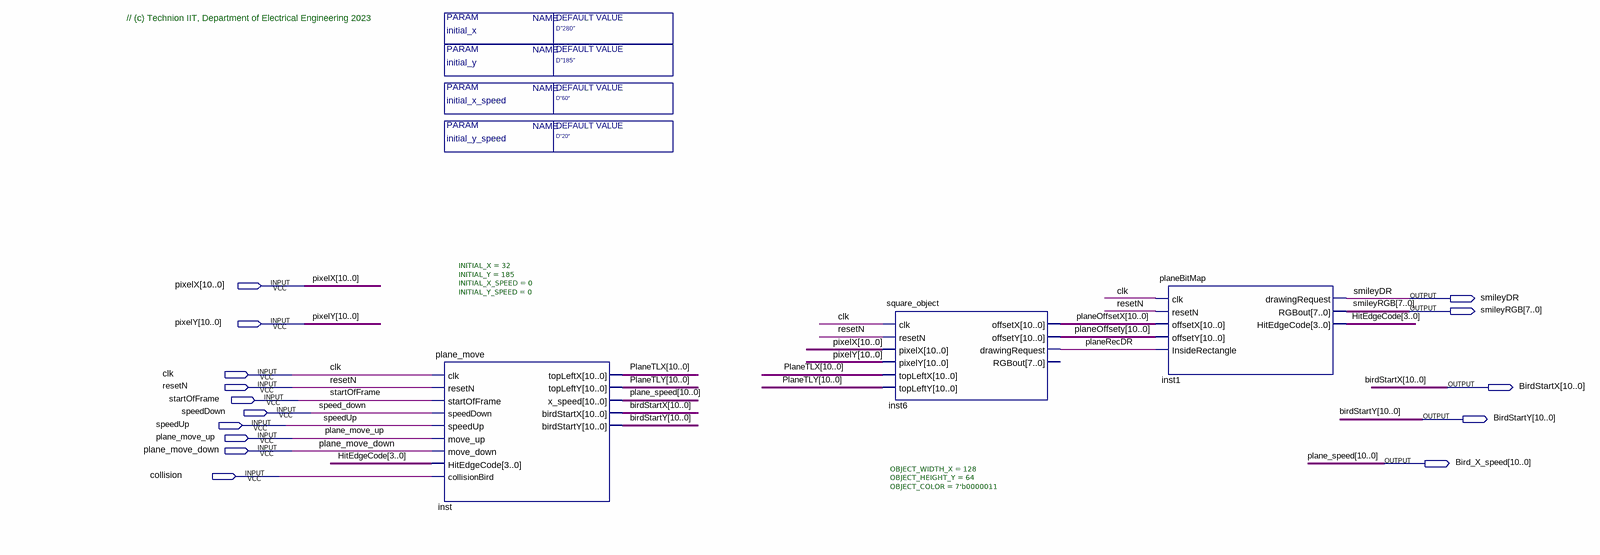
[diagram p0: schematic sheet]
// Quartus schematic Smiley_Block_T.bdf as structural Verilog: 3 symbols, 15 pins
module Smiley_Block_T #(parameter initial_x = "D\"280\"", parameter initial_y = "D\"185\"", parameter initial_x_speed = "D\"60\"", parameter initial_y_speed = "D\"20\"") (
  input  [10:0] pixelX,
  input  [10:0] pixelY,
  input  clk,
  input  resetN,
  input  startOfFrame,
  input  speedDown,
  input  speedUp,
  input  plane_move_up,
  input  plane_move_down,
  input  collision,
  output smileyDR,
  output [7:0] smileyRGB,
  output [10:0] BirdStartX,
  output [10:0] BirdStartY,
  output [10:0] Bird_X_speed
);

  wire planeRecDR;
  wire [3:0] HitEdgeCode;
  wire [10:0] planeOffsetX, planeOffsety, PlaneTLX, PlaneTLY;

  plane_move #(.INITIAL_X(32), .INITIAL_Y(185), .INITIAL_X_SPEED(0), .INITIAL_Y_SPEED(0)) inst (
    .clk(clk), .resetN(resetN), .startOfFrame(startOfFrame), .speedDown(speedDown), .speedUp(speedUp),
    .move_up(plane_move_up), .move_down(plane_move_down), .HitEdgeCode(HitEdgeCode),
    .collisionBird(collision), .topLeftX(PlaneTLX), .topLeftY(PlaneTLY), .x_speed(Bird_X_speed),
    .birdStartX(BirdStartX), .birdStartY(BirdStartY));
  square_object #(.OBJECT_WIDTH_X(128), .OBJECT_HEIGHT_Y(64), .OBJECT_COLOR(7'b0000011)) inst6 (
    .clk(clk), .resetN(resetN), .pixelX(pixelX), .pixelY(pixelY), .topLeftX(PlaneTLX), .topLeftY(PlaneTLY),
    .offsetX(planeOffsetX), .offsetY(planeOffsety), .drawingRequest(planeRecDR));  // open: RGBout
  planeBitMap inst1 (
    .clk(clk), .resetN(resetN), .offsetX(planeOffsetX), .offsetY(planeOffsety), .InsideRectangle(planeRecDR),
    .drawingRequest(smileyDR), .RGBout(smileyRGB), .HitEdgeCode(HitEdgeCode));

  // Other names for the same wires on the sheet: plane_speed[10:0] = Bird_X_speed; speed_down = speedDown

  // Notes on the sheet:
  //   // (c) Technion IIT, Department of Electrical Engineering 2023
endmodule
